# Altium schematic sheet PowerWB2.SchDoc: Fuente de alimentación
size A4; Author: Grupo 5; DrawnBy: Bruno Valinoti; SheetNumber: 1
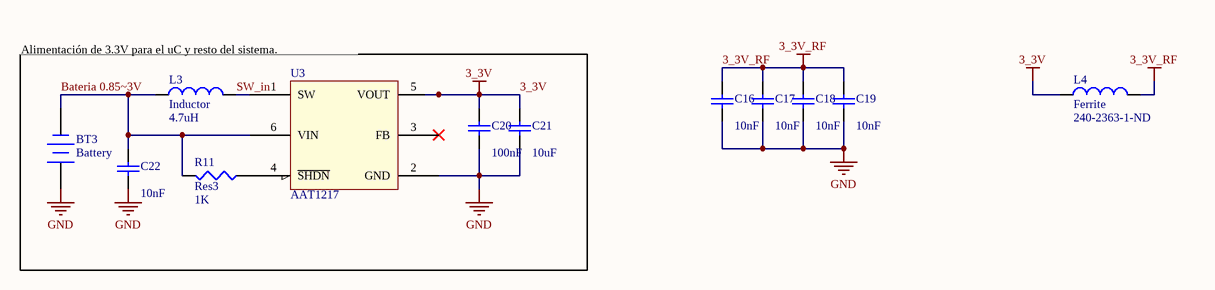
[diagram p0: PowerWB2.SchDoc]

## Parts
BT3  Battery  [BAT-2]
C16  value 10nF  [1608[0603]]  (hidden comment: Cap Semi)
C17  value 10nF  [1608[0603]]  (hidden comment: Cap Semi)
C18  value 10nF  [1608[0603]]  (hidden comment: Cap Semi)
C19  value 10nF  [1608[0603]]  (hidden comment: Cap Semi)
C20  value 100nF  [1608[0603]]  (hidden comment: Cap Semi)
C21  value 10uF  [1608[0603]]  (hidden comment: Cap Semi)
C22  value 10nF  [1608[0603]]  (hidden comment: Cap Semi)
L3  Inductor  value 4.7uH  [0402-A]
L4  Ferrite  value 240-2363-1-ND  [0402-A]
R11  Res3  value 1K  [6-0805_M]
U3  AAT1217  [SOT26A-6N]

## Nets
3_3V: C20.2 C21.2 L4.1 U3.5(VOUT)
3_3V_RF: C16.2 C17.2 C18.2 C19.2 L4.2
GND: BT3.1(+) C16.1 C17.1 C18.1 C19.1 C20.1 C21.1 C22.1 U3.2(GND)
Bateria 0.85~3V: BT3.2(-) C22.2 L3.1 R11.2 U3.6(VIN)
SW_in: L3.2 U3.1(SW)
NetR11_1: R11.1 U3.4(~{SHDN})

Not connected (* = marked no-connect by the designer): U3 3(FB)*

## Notes on the sheet
- Alimentación de 3.3V para el uC y resto del sistema.
- Title
- Size:
- Date:
- A4
- Number:
- Time:
- Revision:
- Sheet
- of
- File:

## Library data of the parts
BT3 = Battery: Multicell Battery; Published: 24-Mar-1999; LatestRevisionDate: 17-Jul-2002; LatestRevisionNote: Re-released for DXP Platform.; PackageReference: BAT-2; Publisher: Altium Limited; PackageDescription: Battery; 2 Leads
C16-C22 = Cap Semi: Capacitor (Semiconductor SIM Model); Published: 8-Jun-2000; LatestRevisionDate: 29-May-2009; LatestRevisionNote: IPC-7351 Footprint Added.; PackageReference: C1206; Publisher: Altium Limited; PackageDescription: Chip Capacitor
L3 L4 = Inductor: Code_IEC: 1005; Published: 8-Jun-2000; LatestRevisionDate: 29-May-2009; LatestRevisionNote: IPC-7351 Footprint Added.; PackageReference: 0402-A; Publisher: Altium Limited; PackageDescription: Chip Inductor; Code_JEITA: 0402
R11 = Res3: Resistor; Published: 8-Jun-2000; LatestRevisionDate: 29-May-2009; LatestRevisionNote: IPC-7351 Footprint Added.; PackageReference: J1-0603; Publisher: Altium Limited; PackageDescription: Chip Resistor